# Altium schematic sheet driver_V1.1.SchDoc
size A4
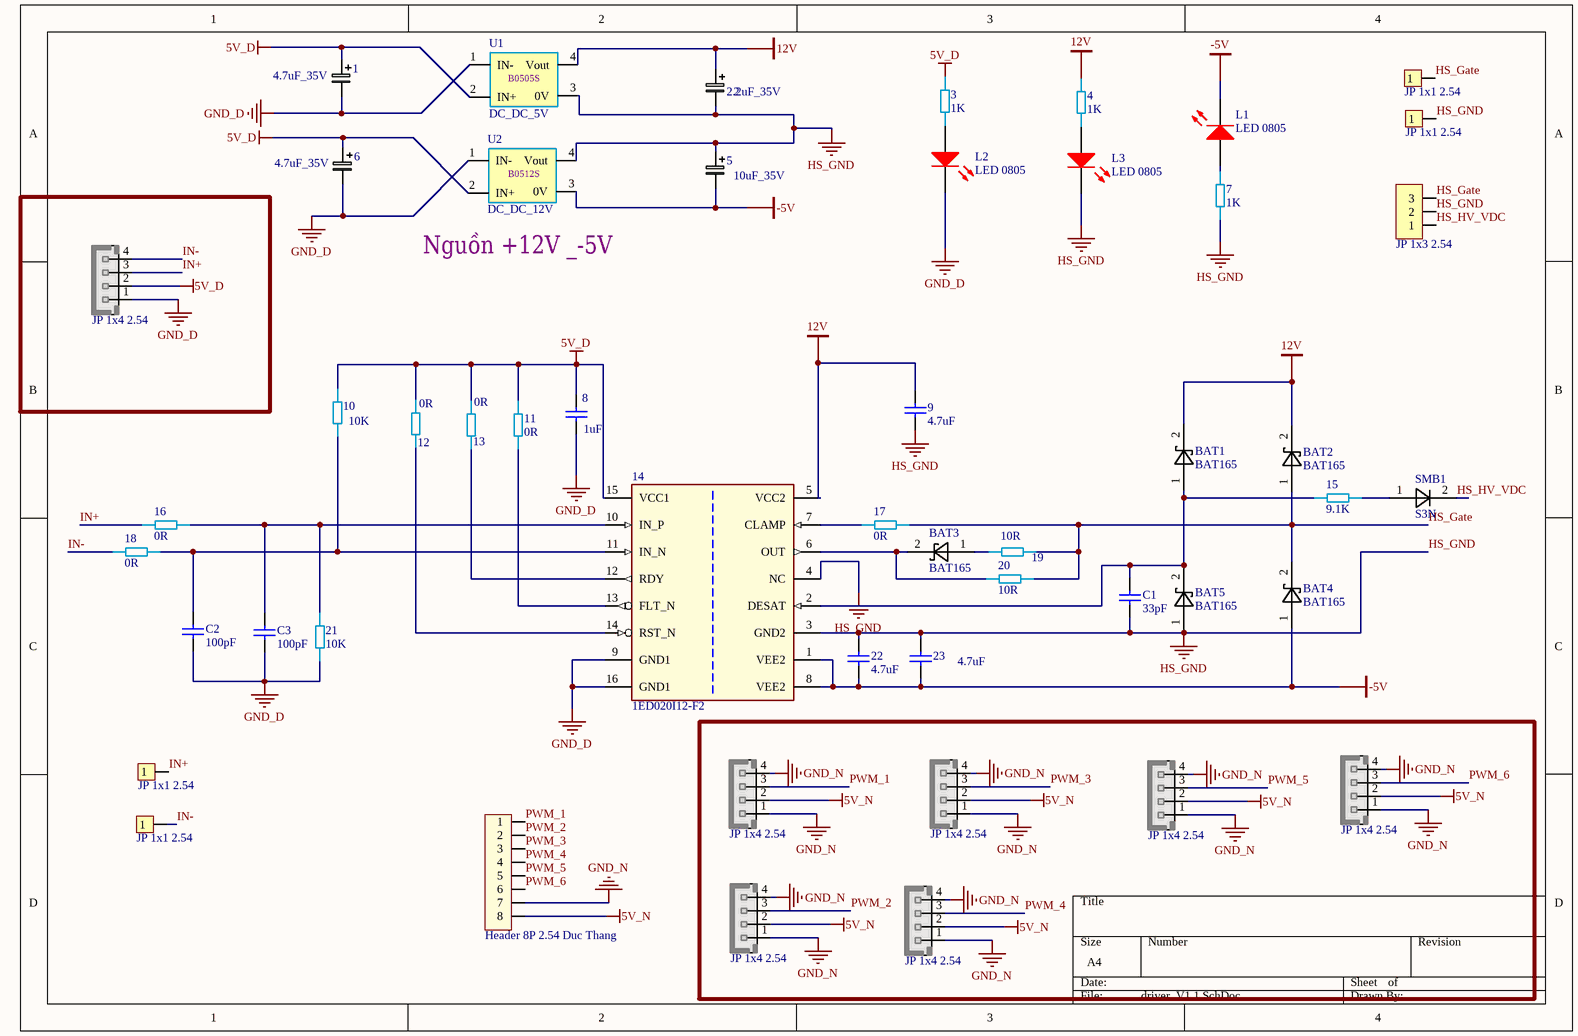
[diagram p0: driver_V1.1.SchDoc]

## Parts
1  4.7uF_35V  [tu_4x5.4mm]
2  2.2uF_35V  [tu_4x5.4mm]
3  1K  [RES1206]
4  1K  [RES1206]
5  10uF_35V  [tu_4x5.4mm]
6  4.7uF_35V  [tu_4x5.4mm]
7  1K  [RES1206]
8  1uF  [Tu 0805_N]
9  4.7uF  [tu 1206_N]
10  10K  [RES1206]
11  0R  [RES1206]
12  0R  [RES1206]
13  0R  [RES1206]
14  1ED020I12-F2  [SOIC127P1028X264-16N-1]
15  9.1K  [RES_2512]
16  0R  [RES1206]
17  0R  [RES_2512]
18  0R  [RES1206]
19  10R  [RES_2512]
20  10R  [RES_2512]
21  10K  [RES1206]
22  4.7uF  [tu 1206_N]
23  4.7uF  [tu 1206_N]
BAT1  BAT165  [SMB]
BAT2  BAT165  [SMB]
BAT3  BAT165  [SMB]
BAT4  BAT165  [SMB]
BAT5  BAT165  [SMB]
C1  33pF  [Tu 0805_N]
C2  100pF  [Tu 0805_N]
C3  100pF  [Tu 0805_N]
H1  Header 8P 2.54 Duc Thang  [XH2.54M-8]
JP1  JP 1x1 2.54  [test_point]
JP2  JP 1x1 2.54  [test_point]
JP3  JP 1x3 2.54  [XH2.54M-3]
JP4  JP 1x4 2.54  [XH2.54M-4]
JP5  JP 1x1 2.54  [test_point]
JP6  JP 1x1 2.54  [test_point]
JP7  JP 1x4 2.54  [XH2.54M-4]
JP8  JP 1x4 2.54  [XH2.54M-4]
JP9  JP 1x4 2.54  [XH2.54M-4]
JP10  JP 1x4 2.54  [XH2.54M-4]
JP11  JP 1x4 2.54  [XH2.54M-4]
JP12  JP 1x4 2.54  [XH2.54M-4]
L1  LED 0805  [LED-0805-Red]
L2  LED 0805  [LED-0805-Red]
L3  LED 0805  [LED-0805-Red]
SMB1  S3N  [SMB]
U1  DC_DC_5V  [B0505S/D-1W]
U2  DC_DC_12V  [B0512S/D-1W]

## Nets
5V_D: 1.1 3.1 6.1 8.2 10.2 11.1 12.2 13.1 14.15(VCC1) JP4.2 U1.2(IN+) U2.2(IN+)
5V_N: H1.8 JP7.2 JP8.2 JP9.2 JP10.2 JP11.2 JP12.2
12V: 2.1 4.1 9.2 14.5(VCC2) BAT1.2 BAT2.2 U1.4(Vout)
-5V: 5.2 14.1(VEE2) 14.8(VEE2) 22.1 23.1 BAT4.1 L1.2(K) U2.3(0V)
GND_D: 1.2 6.2 8.1 14.9(GND1) 14.16(GND1) 21.2 C2.1 C3.1 JP4.1 L2.2(K) U1.1(IN-) U2.1(IN-)
GND_N: H1.7 JP7.1 JP7.4 JP8.1 JP8.4 JP9.1 JP9.4 JP10.1 JP10.4 JP11.1 JP11.4 JP12.1 JP12.4
HS_GND: 2.2 5.1 7.2 9.1 14.3(GND2) 14.4(NC) 22.2 23.2 BAT5.1 C1.1 JP2.1 JP3.2 L3.2(K) U1.3(0V) U2.4(Vout)
HS_Gate: 17.2 19.2 20.2 BAT2.1 BAT4.2 JP1.1 JP3.3
HS_HV_VDC: JP3.1 SMB1.2
IN+: 16.2 JP4.3 JP5.1
IN-: 18.2 JP4.4 JP6.1
PWM_1: H1.1 JP8.3
PWM_2: H1.2 JP11.3
PWM_3: H1.3 JP9.3
PWM_4: H1.4 JP12.3
PWM_5: H1.5 JP10.3
PWM_6: H1.6 JP7.3
Net3_2: 3.2 L2.1(A)
Net4_2: 4.2 L3.1(A)
Net7_1: 7.1 L1.1(A)
Net10_1: 10.1 14.11(IN_N) 18.1 C2.2
Net11_2: 11.2 14.13(FLT_N)
Net12_1: 12.1 14.14(RST_N)
Net13_2: 13.2 14.12(RDY)
Net14_2: 14.2(DESAT) 15.1 BAT1.1 BAT5.2 C1.2
Net14_6: 14.6(OUT) 20.1 BAT3.2
Net14_7: 14.7(CLAMP) 17.1
Net14_10: 14.10(IN_P) 16.1 21.1 C3.2
Net15_2: 15.2 SMB1.1
Net19_1: 19.1 BAT3.1

## Notes on the sheet
- (near U2) Nguồn +12V _-5V
- (in symbol DC_DC_5v) B0505S
- (in symbol DC_DC_12v) B0512S

## Library data of the parts
1 2 5 6 = capacitor_electric
3 4 7 10-13 15-21 = 311-0.0GRTR-ND
8 C1-C3 = cap_0805
9 22 23 = cap_1210
14 = 1ED020I12-F2: Single IGBT Driver IC; Manufacturer: Infineon Technologies; Manufacturer Order Number: 1ED020I12-F2; PackageReference: PG-DSO-16-15
H1 = Header 8P 2.54 Duc Thang: Cắm; Ten_Linh_Kien: Header 8P XH2.54-8P Đực Thẳng; Don_Vi: Con; Ma_Hang: MH003366; Chung_Loai: Cắm
JP1 JP2 JP5 JP6 = JP 1x1 2.54 Duc Thang: Cắm; Ten_Linh_Kien: Jump Đơn Đực 2.54MM 1x40P Thẳng 11MM; Don_Vi: Con; Ma_Hang: MH000903; Ghi_Chu: *; Kieu_Chan: *; Chung_Loai: Cắm
JP3 = JP 1x3 2.54 Duc Cong: Cắm; Ten_Linh_Kien: Jump Đơn Đực 2.54MM 1x40P Cong Đứng; Don_Vi: Con; Ma_Hang: MH000904; Ghi_Chu: *; Kieu_Chan: *; Chung_Loai: Cắm
JP4 JP7-JP12 = JP 1x4 2.54 Duc Thang: Cắm; Ten_Linh_Kien: Jump Đơn Đực 2.54MM 1x40P Thẳng 11MM; Don_Vi: Con; Ma_Hang: MH000903; Ghi_Chu: *; Kieu_Chan: *; Chung_Loai: Cắm
L1-L3 = LED 0805 Do: Dán; Don_Vi: Con; Ma_Hang: MH000897; Ten_Linh_Kien: LED 0805 Màu Đỏ (Red); Ghi_Chu: *; Kieu_Chan: *; Chung_Loai: Dán
SMB1 = S3A-S3N